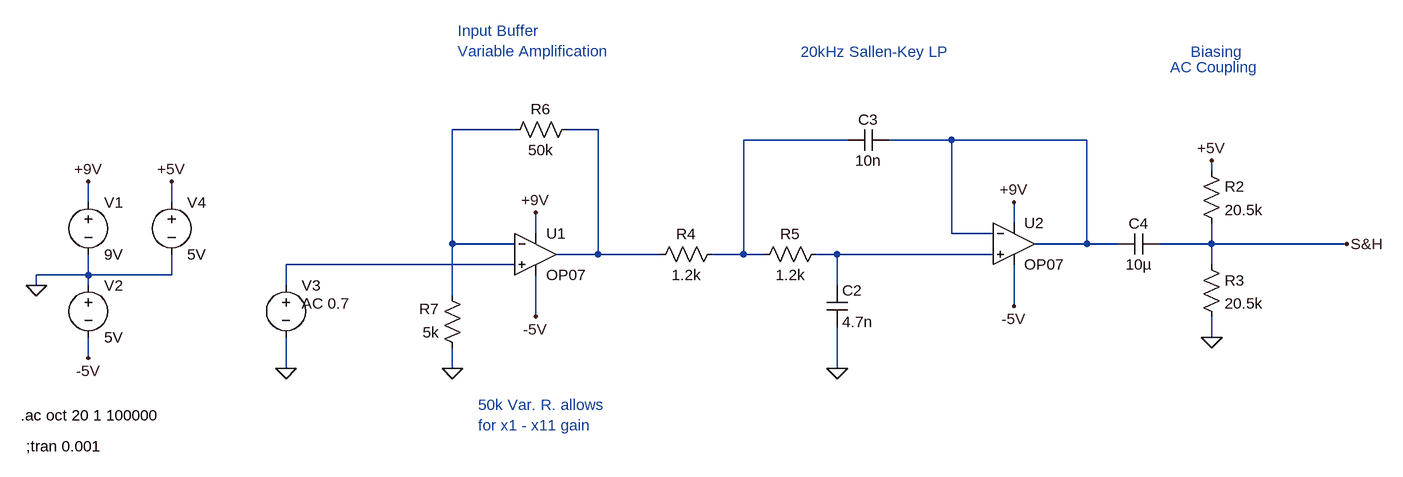
[diagram p0: schematic AudioInput.asc]
AudioInput.asc, the LTspice schematic file:
Version 4
SHEET 1 2964 680
WIRE 624 -48 528 -48
WIRE 752 -48 704 -48
WIRE 1136 -32 976 -32
WIRE 1296 -32 1200 -32
WIRE 1504 -32 1296 -32
WIRE 1696 16 1696 0
WIRE -32 64 -32 32
WIRE 96 64 96 32
WIRE 1392 96 1392 64
WIRE 656 112 656 80
WIRE 1296 112 1296 -32
WIRE 1360 112 1296 112
WIRE 528 128 528 -48
WIRE 624 128 528 128
WIRE 1504 128 1504 -32
WIRE 1504 128 1424 128
WIRE 1552 128 1504 128
WIRE 1696 128 1696 96
WIRE 1696 128 1616 128
WIRE 1904 128 1696 128
WIRE 752 144 752 -48
WIRE 752 144 688 144
WIRE 848 144 752 144
WIRE 976 144 976 -32
WIRE 976 144 928 144
WIRE 1008 144 976 144
WIRE 1120 144 1088 144
WIRE 1360 144 1120 144
WIRE 624 160 272 160
WIRE 1696 160 1696 128
WIRE -32 176 -32 144
WIRE -32 176 -112 176
WIRE 96 176 96 144
WIRE 96 176 -32 176
WIRE -112 192 -112 176
WIRE -32 192 -32 176
WIRE 272 192 272 160
WIRE 1120 192 1120 144
WIRE 528 208 528 128
WIRE 1392 224 1392 160
WIRE 656 240 656 176
WIRE 1696 272 1696 240
WIRE -32 304 -32 272
WIRE 272 320 272 272
WIRE 528 320 528 288
WIRE 1120 320 1120 256
FLAG -112 192 0
FLAG -32 32 +9V
FLAG 96 32 +5V
FLAG -32 304 -5V
FLAG 656 240 -5V
FLAG 656 80 +9V
FLAG 1696 272 0
FLAG 528 320 0
FLAG 1392 224 -5V
FLAG 1392 64 +9V
FLAG 1120 320 0
FLAG 1696 0 +5V
FLAG 1904 128 S&H
FLAG 272 320 0
SYMBOL voltage -32 48 R0
WINDOW 123 0 0 Left 0
WINDOW 39 0 0 Left 0
SYMATTR InstName V1
SYMATTR Value 9V
SYMBOL voltage -32 176 R0
WINDOW 123 0 0 Left 0
WINDOW 39 0 0 Left 0
SYMATTR InstName V2
SYMATTR Value 5V
SYMBOL voltage 96 48 R0
WINDOW 123 0 0 Left 0
WINDOW 39 0 0 Left 0
SYMATTR InstName V4
SYMATTR Value 5V
SYMBOL res 1680 0 R0
SYMATTR InstName R2
SYMATTR Value 20.5k
SYMBOL res 1680 144 R0
SYMATTR InstName R3
SYMATTR Value 20.5k
SYMBOL res 944 128 R90
WINDOW 0 0 56 VBottom 2
WINDOW 3 32 56 VTop 2
SYMATTR InstName R4
SYMATTR Value 1.2k
SYMBOL res 1104 128 R90
WINDOW 0 0 56 VBottom 2
WINDOW 3 32 56 VTop 2
SYMATTR InstName R5
SYMATTR Value 1.2k
SYMBOL cap 1104 192 R0
SYMATTR InstName C2
SYMATTR Value 4.7n
SYMBOL res 720 -64 R90
WINDOW 0 0 56 VBottom 2
WINDOW 3 32 56 VTop 2
SYMATTR InstName R6
SYMATTR Value 50k
SYMBOL res 544 304 R180
WINDOW 0 36 76 Left 2
WINDOW 3 36 40 Left 2
SYMATTR InstName R7
SYMATTR Value 5k
SYMBOL cap 1200 -48 R90
WINDOW 0 0 32 VBottom 2
WINDOW 3 32 32 VTop 2
SYMATTR InstName C3
SYMATTR Value 10n
SYMBOL Opamps\\OP07 656 80 R0
SYMATTR InstName U1
SYMBOL Opamps\\OP07 1392 64 R0
SYMATTR InstName U2
SYMBOL cap 1616 112 R90
WINDOW 0 0 32 VBottom 2
WINDOW 3 32 32 VTop 2
SYMATTR InstName C4
SYMATTR Value 10µ
SYMBOL voltage 272 176 R0
WINDOW 3 24 96 Invisible 2
WINDOW 123 24 44 Left 2
WINDOW 39 0 0 Left 0
SYMATTR Value ""
SYMATTR Value2 AC 0.7
SYMATTR InstName V3
TEXT -136 392 Left 2 !.ac oct 20 1 100000
TEXT -128 440 Left 2 !;tran 0.001
TEXT 1632 -144 Left 2 ;AC Coupling
TEXT 536 -200 Left 2 ;Input Buffer\nVariable Amplification
TEXT 1064 -168 Left 2 ;20kHz Sallen-Key LP
TEXT 1664 -168 Left 2 ;Biasing
TEXT 568 376 Left 2 ;50k Var. R. allows\nfor x1 - x11 gain

The netlist it stands for:
* AudioInput.asc
V1 +9V 0 9V
V2 0 -5V 5V
V4 +5V 0 5V
R2 +5V S&H 20.5k
R3 S&H 0 20.5k
R4 N003 N002 1.2k
R5 N005 N003 1.2k
C2 N005 0 4.7n
R6 N002 N001 50k
R7 0 N001 5k
C3 N004 N003 10n
XU1 N006 N001 +9V -5V N002 LT1001  ; OP07, pins In+ In- V+ V- OUT
XU2 N005 N004 +9V -5V N004 LT1001  ; OP07, pins In+ In- V+ V- OUT
C4 S&H N004 10µ
V3 N006 0 AC 0.7
.ac oct 20 1 100000
;tran 0.001
* AC Coupling
* Input Buffer
* Variable Amplification
* 20kHz Sallen-Key LP
* Biasing
* 50k Var. R. allows
* for x1 - x11 gain
.lib LTC.lib
.backanno
.end